# Altium schematic sheet USB_Charge.SchDoc
size A; SheetNumber: 5; SheetTotal: 5
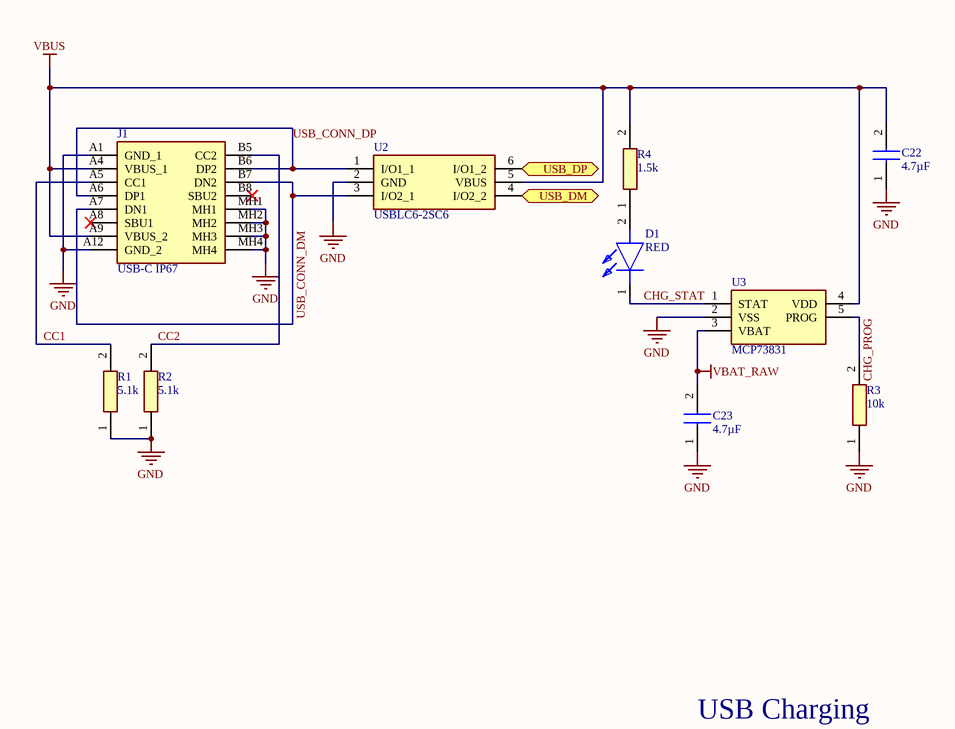
[diagram p0: USB_Charge.SchDoc]

## Parts
C22  4.7µF  [GRM18x]
C23  4.7µF  [GRM18x]
D1  RED  [LEDC1608X55N]
J1  USB-C IP67  [USB4730GFAKIT]
R1  5.1k  [RESC1005X35N]
R2  5.1k  [RESC1005X35N]
R3  10k  [RESC1005X35N]
R4  1.5k  [RESC1005X35N]
U2  USBLC6-2SC6  [SOT95P280X145-6N]
U3  MCP73831  [SOT95P270X145-5N]

## Ports
USB_DM (bidir, see Boat_Receiver[1B], Core_nRF52840[2D]), USB_DP (bidir, see Boat_Receiver[1B], Core_nRF52840[2D])

## Nets
GND: C22.1 C23.1 J1.A1(GND_1) J1.A12(GND_2) J1.MH1 J1.MH2 J1.MH3 J1.MH4 R1.1 R2.1 R3.1 U2.2(GND) U3.2(VSS)
VBAT_RAW: C23.2 U3.3(VBAT)
VBUS: C22.2 J1.A4(VBUS_1) J1.A9(VBUS_2) R4.2 U2.5(VBUS) U3.4(VDD)
CC1: J1.A5(CC1) R1.2
CC2: J1.B5(CC2) R2.2
CHG_PROG: R3.2 U3.5(PROG)
CHG_STAT: D1.1(K) U3.1(STAT)
USB_CONN_DM: J1.A7(DN1) J1.B7(DN2) U2.3(I/O2_1)
USB_CONN_DP: J1.A6(DP1) J1.B6(DP2) U2.1(I/O1_1)
USB_DM: U2.4(I/O2_2) ; port USB_DM
USB_DP: U2.6(I/O1_2) ; port USB_DP
NetD1_2: D1.2(A) R4.1

Not connected (* = marked no-connect by the designer): J1 A8(SBU1)* B8(SBU2)*

## Notes on the sheet
- USB Charging

## Library data of the parts
C22 C23 = C_4u7F_0603_X7R_16V: 4.7 µF X7R ±10% 16 V; Manufacturer_Name: Murata Electronics; Manufacturer_Part_Number: GRM188Z71C475KE21D; Height: 0.9mm; LCSC: C389010
D1 = LED_Red_0603: Red LED 631 nm 54 mcd water clear; Manufacturer_Name: Lite-On; Manufacturer_Part_Number: LTST-C191KRKT; Height: 0.55mm; LCSC: C125099
J1 = USB4730-GF-A-KIT: USB-C receptacle, USB 2.0, 16-pin, top-mount SMT, IP67 with USBTJ-04 gasket; Manufacturer_Name: GCT (GLOBAL CONNECTOR TECHNOLOGY); Manufacturer_Part_Number: USB4730-GF-A-KIT; LCSC: C20598701; Digikey: 2073-USB4730-GF-A-KITCT-ND
R1 R2 = R_5k1_0402_0p1pct: 5.1 kΩ thin film ±0.1% 25 ppm; Manufacturer_Name: Yageo Group; Manufacturer_Part_Number: RT0402BRD075K1L; Height: 0.35mm; LCSC: C852856
R3 = R_10k_0402_0p1pct: 10 kΩ thin film ±0.1% 25 ppm; Manufacturer_Name: Yageo Group; Manufacturer_Part_Number: RT0402BRD0710KL; Height: 0.35mm; LCSC: C190095
R4 = R_1k5_0402_0p1pct: 1.5 kΩ thin film ±0.1% 25 ppm; Manufacturer_Name: Yageo Group; Manufacturer_Part_Number: RT0402BRD071K5L; Height: 0.35mm; LCSC: C281775
U2 = USBLC6-2SC6: USB 2.0 ESD 2-line + VBUS; Manufacturer_Name: STMicroelectronics; Height: 1.45mm; Manufacturer_Part_Number: USBLC6-2SC6; LCSC: C7519
U3 = MCP73831T-2ACI_OT: LiPo linear charger 4.20 V 500 mA max; Manufacturer_Name: Microchip; Manufacturer_Part_Number: MCP73831T-2ACI/OT; Height: 1.45mm; LCSC: C424093